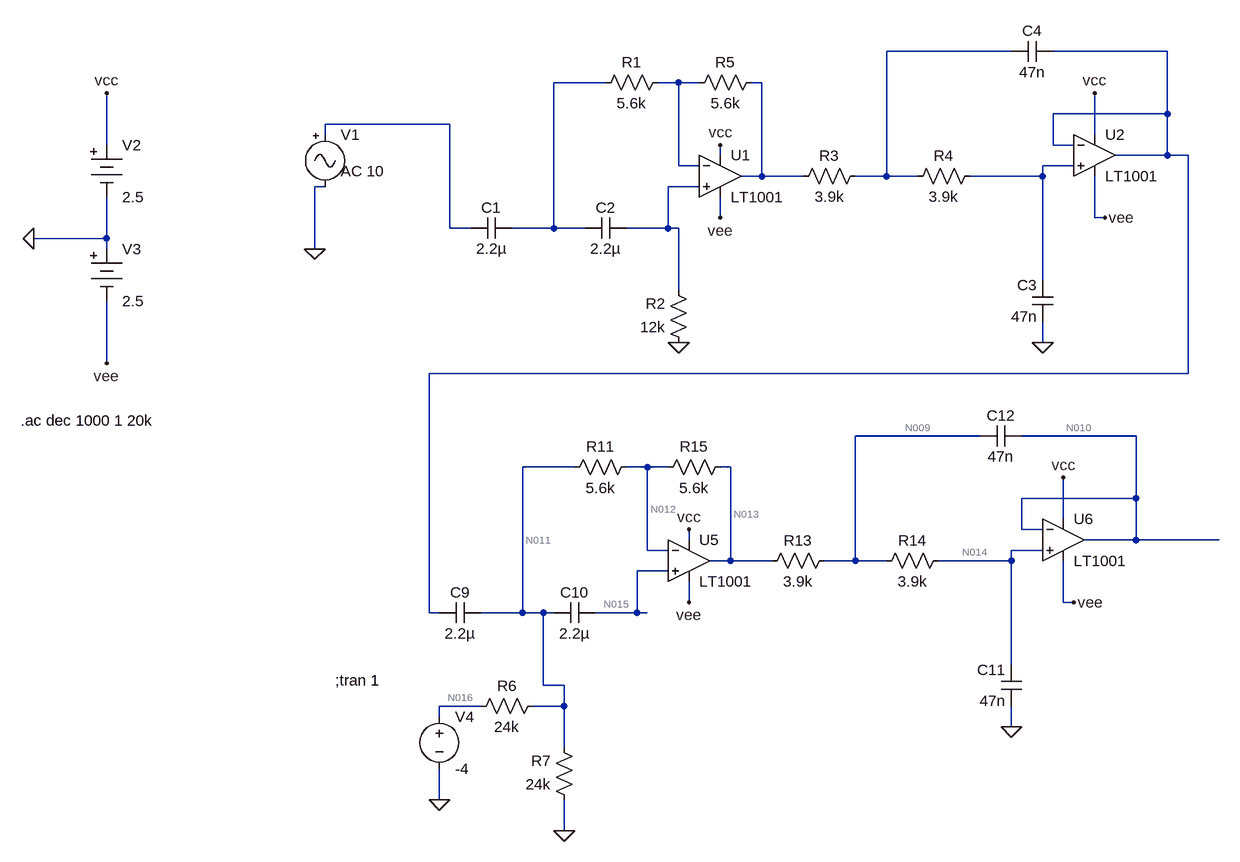
[diagram p0: schematic 10hz-1khz-filter.asc]
10hz-1khz-filter.asc, the LTspice schematic file:
Version 4
SHEET 1 2548 1108
WIRE 880 -112 688 -112
WIRE 1120 -112 944 -112
WIRE 256 -64 176 -64
WIRE 368 -64 336 -64
WIRE 400 -64 368 -64
WIRE 496 -64 480 -64
WIRE 1120 -16 1120 -112
WIRE 1120 -16 944 -16
WIRE 16 0 -176 0
WIRE -176 16 -176 0
WIRE 1008 16 1008 -48
WIRE -512 32 -512 -48
WIRE 944 32 944 -16
WIRE 976 32 944 32
WIRE 432 48 432 32
WIRE 1120 48 1120 -16
WIRE 1120 48 1040 48
WIRE 1152 48 1120 48
WIRE 368 64 368 -64
WIRE 400 64 368 64
WIRE 976 64 928 64
WIRE 496 80 496 -64
WIRE 496 80 464 80
WIRE 560 80 496 80
WIRE 688 80 688 -112
WIRE 688 80 640 80
WIRE 736 80 688 80
WIRE 928 80 928 64
WIRE 928 80 816 80
WIRE -176 96 -192 96
WIRE 400 96 352 96
WIRE 432 144 432 112
WIRE 1008 144 1008 80
WIRE 1024 144 1008 144
WIRE 16 160 16 0
WIRE 48 160 16 160
WIRE 176 160 176 -64
WIRE 176 160 112 160
WIRE 224 160 176 160
WIRE 352 160 352 96
WIRE 352 160 288 160
WIRE 368 160 352 160
WIRE -512 176 -512 112
WIRE -512 176 -624 176
WIRE -512 192 -512 176
WIRE -192 192 -192 96
WIRE 928 240 928 80
WIRE 368 256 368 160
WIRE 928 336 928 304
WIRE -512 368 -512 272
WIRE 1152 384 1152 48
WIRE 1152 384 -16 384
WIRE 832 480 640 480
WIRE 1072 480 896 480
WIRE 208 528 128 528
WIRE 320 528 288 528
WIRE 352 528 320 528
WIRE 448 528 432 528
WIRE 1072 576 1072 480
WIRE 1072 576 896 576
WIRE 960 608 960 544
WIRE 896 624 896 576
WIRE 928 624 896 624
WIRE 384 640 384 624
WIRE 1072 640 1072 576
WIRE 1072 640 992 640
WIRE 1200 640 1072 640
WIRE 320 656 320 528
WIRE 352 656 320 656
WIRE 928 656 880 656
WIRE 448 672 448 528
WIRE 448 672 416 672
WIRE 512 672 448 672
WIRE 640 672 640 480
WIRE 640 672 592 672
WIRE 688 672 640 672
WIRE 880 672 880 656
WIRE 880 672 768 672
WIRE 352 688 304 688
WIRE 384 736 384 704
WIRE 960 736 960 672
WIRE 976 736 960 736
WIRE -16 752 -16 384
WIRE 0 752 -16 752
WIRE 128 752 128 528
WIRE 128 752 64 752
WIRE 160 752 128 752
WIRE 176 752 160 752
WIRE 304 752 304 688
WIRE 304 752 240 752
WIRE 320 752 304 752
WIRE 880 832 880 672
WIRE 160 864 160 752
WIRE 192 864 160 864
WIRE 64 896 0 896
WIRE 192 896 192 864
WIRE 192 896 144 896
WIRE 0 912 0 896
WIRE 880 928 880 896
WIRE 192 960 192 896
WIRE 0 1040 0 992
WIRE 192 1088 192 1040
FLAG 368 336 0
FLAG 928 336 0
FLAG -192 192 0
FLAG -512 -48 vcc
FLAG -512 368 vee
FLAG -624 176 0
FLAG 432 32 vcc
FLAG 1008 -48 vcc
FLAG 432 144 vee
FLAG 1024 144 vee
FLAG 880 928 0
FLAG 384 624 vcc
FLAG 960 544 vcc
FLAG 384 736 vee
FLAG 976 736 vee
FLAG 192 1088 0
FLAG 0 1040 0
SYMBOL cap 112 144 R90
WINDOW 0 0 32 VBottom 2
WINDOW 3 32 32 VTop 2
SYMATTR InstName C1
SYMATTR Value 2.2µ
SYMBOL cap 288 144 R90
WINDOW 0 0 32 VBottom 2
WINDOW 3 32 32 VTop 2
SYMATTR InstName C2
SYMATTR Value 2.2µ
SYMBOL cap 944 304 R180
WINDOW 0 24 56 Left 2
WINDOW 3 24 8 Left 2
SYMATTR InstName C3
SYMATTR Value 47n
SYMBOL res 352 -80 R90
WINDOW 0 0 56 VBottom 2
WINDOW 3 32 56 VTop 2
SYMATTR InstName R1
SYMATTR Value 5.6k
SYMBOL res 384 352 R180
WINDOW 0 36 76 Left 2
WINDOW 3 36 40 Left 2
SYMATTR InstName R2
SYMATTR Value 12k
SYMBOL res 544 96 R270
WINDOW 0 32 56 VTop 2
WINDOW 3 0 56 VBottom 2
SYMATTR InstName R3
SYMATTR Value 3.9k
SYMBOL res 720 96 R270
WINDOW 0 32 56 VTop 2
WINDOW 3 0 56 VBottom 2
SYMATTR InstName R4
SYMATTR Value 3.9k
SYMBOL OpAmps\\LT1001 432 16 R0
SYMATTR InstName U1
SYMBOL res 496 -80 R90
WINDOW 0 0 56 VBottom 2
WINDOW 3 32 56 VTop 2
SYMATTR InstName R5
SYMATTR Value 5.6k
SYMBOL cap 944 -128 R90
WINDOW 0 0 32 VBottom 2
WINDOW 3 32 32 VTop 2
SYMATTR InstName C4
SYMATTR Value 47n
SYMBOL OpAmps\\LT1001 1008 -16 R0
SYMATTR InstName U2
SYMBOL Misc\\signal -176 0 R0
WINDOW 3 24 44 Left 2
WINDOW 123 24 72 Left 2
WINDOW 39 0 0 Left 0
SYMATTR InstName V1
SYMATTR Value ""
SYMATTR Value2 AC 10
SYMBOL Misc\\battery -512 16 R0
WINDOW 123 0 0 Left 0
WINDOW 39 0 0 Left 0
SYMATTR InstName V2
SYMATTR Value 2.5
SYMBOL Misc\\battery -512 176 R0
WINDOW 123 0 0 Left 0
WINDOW 39 0 0 Left 0
SYMATTR InstName V3
SYMATTR Value 2.5
SYMBOL cap 64 736 R90
WINDOW 0 0 32 VBottom 2
WINDOW 3 32 32 VTop 2
SYMATTR InstName C9
SYMATTR Value 2.2µ
SYMBOL cap 240 736 R90
WINDOW 0 0 32 VBottom 2
WINDOW 3 32 32 VTop 2
SYMATTR InstName C10
SYMATTR Value 2.2µ
SYMBOL cap 896 896 R180
WINDOW 0 24 56 Left 2
WINDOW 3 24 8 Left 2
SYMATTR InstName C11
SYMATTR Value 47n
SYMBOL res 304 512 R90
WINDOW 0 0 56 VBottom 2
WINDOW 3 32 56 VTop 2
SYMATTR InstName R11
SYMATTR Value 5.6k
SYMBOL res 496 688 R270
WINDOW 0 32 56 VTop 2
WINDOW 3 0 56 VBottom 2
SYMATTR InstName R13
SYMATTR Value 3.9k
SYMBOL res 672 688 R270
WINDOW 0 32 56 VTop 2
WINDOW 3 0 56 VBottom 2
SYMATTR InstName R14
SYMATTR Value 3.9k
SYMBOL OpAmps\\LT1001 384 608 R0
SYMATTR InstName U5
SYMBOL res 448 512 R90
WINDOW 0 0 56 VBottom 2
WINDOW 3 32 56 VTop 2
SYMATTR InstName R15
SYMATTR Value 5.6k
SYMBOL cap 896 464 R90
WINDOW 0 0 32 VBottom 2
WINDOW 3 32 32 VTop 2
SYMATTR InstName C12
SYMATTR Value 47n
SYMBOL OpAmps\\LT1001 960 576 R0
SYMATTR InstName U6
SYMBOL res 160 880 R90
WINDOW 0 0 56 VBottom 2
WINDOW 3 32 56 VTop 2
SYMATTR InstName R6
SYMATTR Value 24k
SYMBOL res 208 1056 R180
WINDOW 0 36 76 Left 2
WINDOW 3 36 40 Left 2
SYMATTR InstName R7
SYMATTR Value 24k
SYMBOL voltage 0 896 R0
WINDOW 123 0 0 Left 0
WINDOW 39 0 0 Left 0
SYMATTR InstName V4
SYMATTR Value -4
TEXT -644 456 Left 2 !.ac dec 1000 1 20k
TEXT -160 856 Left 2 !;tran 1

The netlist it stands for:
* 10hz-1khz-filter.asc
C1 N003 N006 2.2µ
C2 N008 N003 2.2µ
C3 0 N007 47n
R1 N004 N003 5.6k
R2 0 N008 12k
R3 N005 N001 3.9k
R4 N001 N007 3.9k
XU1 N008 N004 vcc vee N005 LT1001  ; pins In+ In- V+ V- OUT
R5 N005 N004 5.6k
C4 N002 N001 47n
XU2 N007 N002 vcc vee N002 LT1001  ; pins In+ In- V+ V- OUT
V1 N006 0 AC 10
V2 vcc 0 2.5
V3 0 vee 2.5
C9 N011 N002 2.2µ
C10 N015 N011 2.2µ
C11 0 N014 47n
R11 N012 N011 5.6k
R13 N013 N009 3.9k
R14 N009 N014 3.9k
XU5 N015 N012 vcc vee N013 LT1001  ; pins In+ In- V+ V- OUT
R15 N013 N012 5.6k
C12 N010 N009 47n
XU6 N014 N010 vcc vee N010 LT1001  ; pins In+ In- V+ V- OUT
R6 N011 N016 24k
R7 0 N011 24k
V4 N016 0 -4
.ac dec 1000 1 20k
;tran 1
.lib LTC.lib
.backanno
.end

* Results of the author's LTspice run, read from the files saved beside the schematic
* Operating Point, zero values left out:
*   V(vcc) = 2.5 V
*   V(vee) = -2.5 V
*   V(n011) = -640.7 mV
*   V(n015) = -6.4 mV
*   V(n014) = 627.9 mV
*   V(n012) = -6.401 mV
*   V(n013) = 627.9 mV
*   V(n009) = 627.9 mV
*   V(n010) = 627.9 mV
*   V(n016) = -4 V
*   I(R7) = 26.7 µA
*   I(R6) = 140 µA
*   I(R15) = 113.3 µA
*   I(R14) = 1.133 pA
*   I(R13) = 1.133 pA
*   I(R11) = 113.3 µA
*   I(V4) = 140 µA
*   I(V3) = -8.944 mA
*   I(V2) = -9.057 mA